# EAGLE design Lantern_Vent (EAGLE 9.6.2)
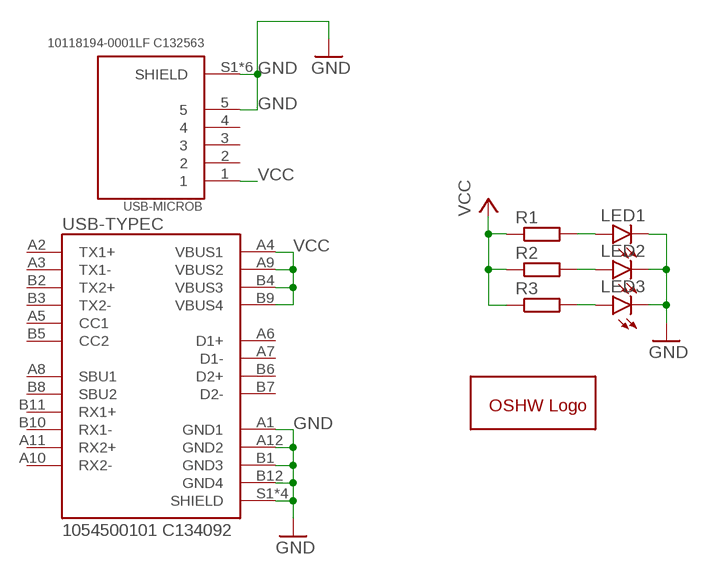
[diagram p0: schematic, sheet 1]

## Parts
GOLD_ORB_SM1  OSHWLOGOLOGO5MM  [OSHW_5MM]
LED1  LEDCHIP-LED0805  [CHIP-LED0805]
LED2  LEDCHIP-LED0805  [CHIP-LED0805]
LED3  LEDCHIP-LED0805  [CHIP-LED0805]
R1  R-EU_R0805  [R0805]
R2  R-EU_R0805  [R0805]
R3  R-EU_R0805  [R0805]
USB-MICROB  10118194-0001LF C132563  10118194-0001LF  [AMPHENOL_10118194-0001LF]
USB-TYPEC  1054500101 C134092  105450-0101  [MOLEX_105450-0101]

## Nets
GND: LED1.C LED2.C LED3.C USB-MICROB.5 USB-MICROB.S1(SHIELD) USB-MICROB.S2(SHIELD) USB-MICROB.S3(SHIELD) USB-MICROB.S4(SHIELD) USB-MICROB.S5(SHIELD) USB-MICROB.S6(SHIELD) USB-TYPEC.A1(GND1) USB-TYPEC.A12(GND2) USB-TYPEC.B1(GND3) USB-TYPEC.B12(GND4) USB-TYPEC.S1(SHIELD) USB-TYPEC.S2(SHIELD) USB-TYPEC.S3(SHIELD) USB-TYPEC.S4(SHIELD)
N$1: LED1.A R1.2
N$2: LED2.A R2.2
N$3: LED3.A R3.2
VCC: R1.1 R2.1 R3.1 USB-MICROB.1 USB-TYPEC.A4(VBUS1) USB-TYPEC.A9(VBUS2) USB-TYPEC.B4(VBUS3) USB-TYPEC.B9(VBUS4)
Unconnected: USB-MICROB.2 USB-MICROB.3 USB-MICROB.4 USB-TYPEC.A2(TX1+) USB-TYPEC.A3(TX1-) USB-TYPEC.A5(CC1) USB-TYPEC.A6(D1+) USB-TYPEC.A7(D1-) USB-TYPEC.A8(SBU1) USB-TYPEC.A10(RX2-) USB-TYPEC.A11(RX2+) USB-TYPEC.B2(TX2+) USB-TYPEC.B3(TX2-) USB-TYPEC.B5(CC2) USB-TYPEC.B6(D2+) USB-TYPEC.B7(D2-) USB-TYPEC.B8(SBU2) USB-TYPEC.B10(RX1-) USB-TYPEC.B11(RX1+)

## Library data of the parts
GOLD_ORB_SM1 = oshw:OSHWLOGO: The OSHW logo for PCB layout
LED1-LED3 = led:LED: LED OSRAM: - CHIPLED LG R971, LG N971, LY N971, LG Q971, LY Q971, LO R971, LY R971 LH N974, LH R974 LS Q976, LO Q976, LY Q976 LO Q996 - Hyper CHIPLED LW Q18S LB Q993, LB Q99A, LB R99A - SideLED LS A670, LO A670, LY A670, LG A670, LP A670 LB A673, LV A673, LT A673, LW A673 LH A674 LY A675 LS A676, LA A676, LO A676, LY A676, LW A676 LS A679, LY A679, LG A679 - Hyper Micro SIDELED® LS Y876, LA Y876, LO Y876, LY Y876 LT Y87S - SmartLED LW L88C, LW L88S LB L89C, LB L89S, LG L890 LS L89K, LO L89K, LY L89K LS L896, LA L896, LO L896, LY L896 - TOPLED LS T670, LO T670, LY T670, LG T670, LP T670 LSG T670, LSP T670, LSY T670, LOP T670, LYG T670 LG T671, LOG T671, LSG T671 LB T673, LV T673, LT T673, LW T673 LH T674 LS T676, LA T676, LO T676, LY T676, LB T676, LH T676, LSB T676, LW T676 LB T67C, LV T67C, LT T67C, LS T67K, LO T67K, LY T67K, LW E67C LS E67B, LA E67B, LO E67B, LY E67B, LB E67C, LV E67C, LT E67C LW T67C LS T679, LY T679, LG T679 LS T770, LO T770, LY T770, LG T770, LP T770 LB T773, LV T773, LT T773, LW T773 LH T774 LS E675, LA E675, LY E675, LS T675 LS T776, LA T776, LO T776, LY T776, LB T776 LHGB T686 LT T68C, LB T68C - Hyper Mini TOPLED® LB M676 - Mini TOPLED Santana® LG M470 LS M47K, LO M47K, LY M47K Source: http://www.osram.convergy.de LUXEON: - LUMILED® LXK2-PW12-R00, LXK2-PW12-S00, LXK2-PW14-U00, LXK2-PW14-V00 LXK2-PM12-R00, LXK2-PM12-S00, LXK2-PM14-U00 LXK2-PE12-Q00, LXK2-PE12-R00, LXK2-PE12-S00, LXK2-PE14-T00, LXK2-PE14-U00 LXK2-PB12-K00, LXK2-PB12-L00, LXK2-PB12-M00, LXK2-PB14-N00, LXK2-PB14-P00, LXK2-PB14-Q00 LXK2-PR12-L00, LXK2-PR12-M00, LXK2-PR14-Q00, LXK2-PR14-R00 LXK2-PD12-Q00, LXK2-PD12-R00, LXK2-PD12-S00 LXK2-PH12-R00, LXK2-PH12-S00 LXK2-PL12-P00, LXK2-PL12-Q00, LXK2-PL12-R00 Source: www.luxeon.com KINGBRIGHT: KA-3528ASYC Source: www.kingbright.com
R1-R3 = rcl:R-EU_: RESISTOR, European symbol; SPICEPREFIX: R
USB-MICROB = 10118194-0001LF:10118194-0001LF: Micro Usb, 2.0 Type b, Rcpt, Smt Check prices <https://snapeda.com/parts/10118194-0001LF/Amphenol%20ICC%20%28FCI%29/view-part/?ref=eda>; ARROW_ELECTRONICS-PURCHASE-URL: https://snapeda.com/shop?store=Arrow+Electronics&id=4816633; AVAILABILITY: Good; DESCRIPTION: USB - micro B USB 2.0 Receptacle Connector 5 Position Surface Mount, Right Angle; Through Hole; DIGIKEY-PURCHASE-URL: https://snapeda.com/shop?store=DigiKey&id=4816633; MF: Amphenol ICC (FCI); MOUSER-PURCHASE-URL: https://snapeda.com/shop?store=Mouser&id=4816633; MP: 10118194-0001LF; PACKAGE: None; PRICE: None
USB-TYPEC = 105450-0101:105450-0101: USB Shielded I/O Receptacle; Type C; Right Angle; Surface Mount; Gold over Nickel Check prices <https://snapeda.com/parts/1054500101/Molex/view-part/?ref=eda>; AVAILABILITY: Good; DESCRIPTION: USB-C (USB TYPE-C) USB 3.2 Gen 2 (USB 3.1 Gen 2, Superspeed + (USB 3.1)) Receptacle Connector 24 Position Surface Mount, Right Angle; Through Hole; DIGIKEY-PURCHASE-URL: https://snapeda.com/shop?store=DigiKey&id=448528; MF: Molex; MP: 1054500101; PACKAGE: None; PRICE: None

## Board
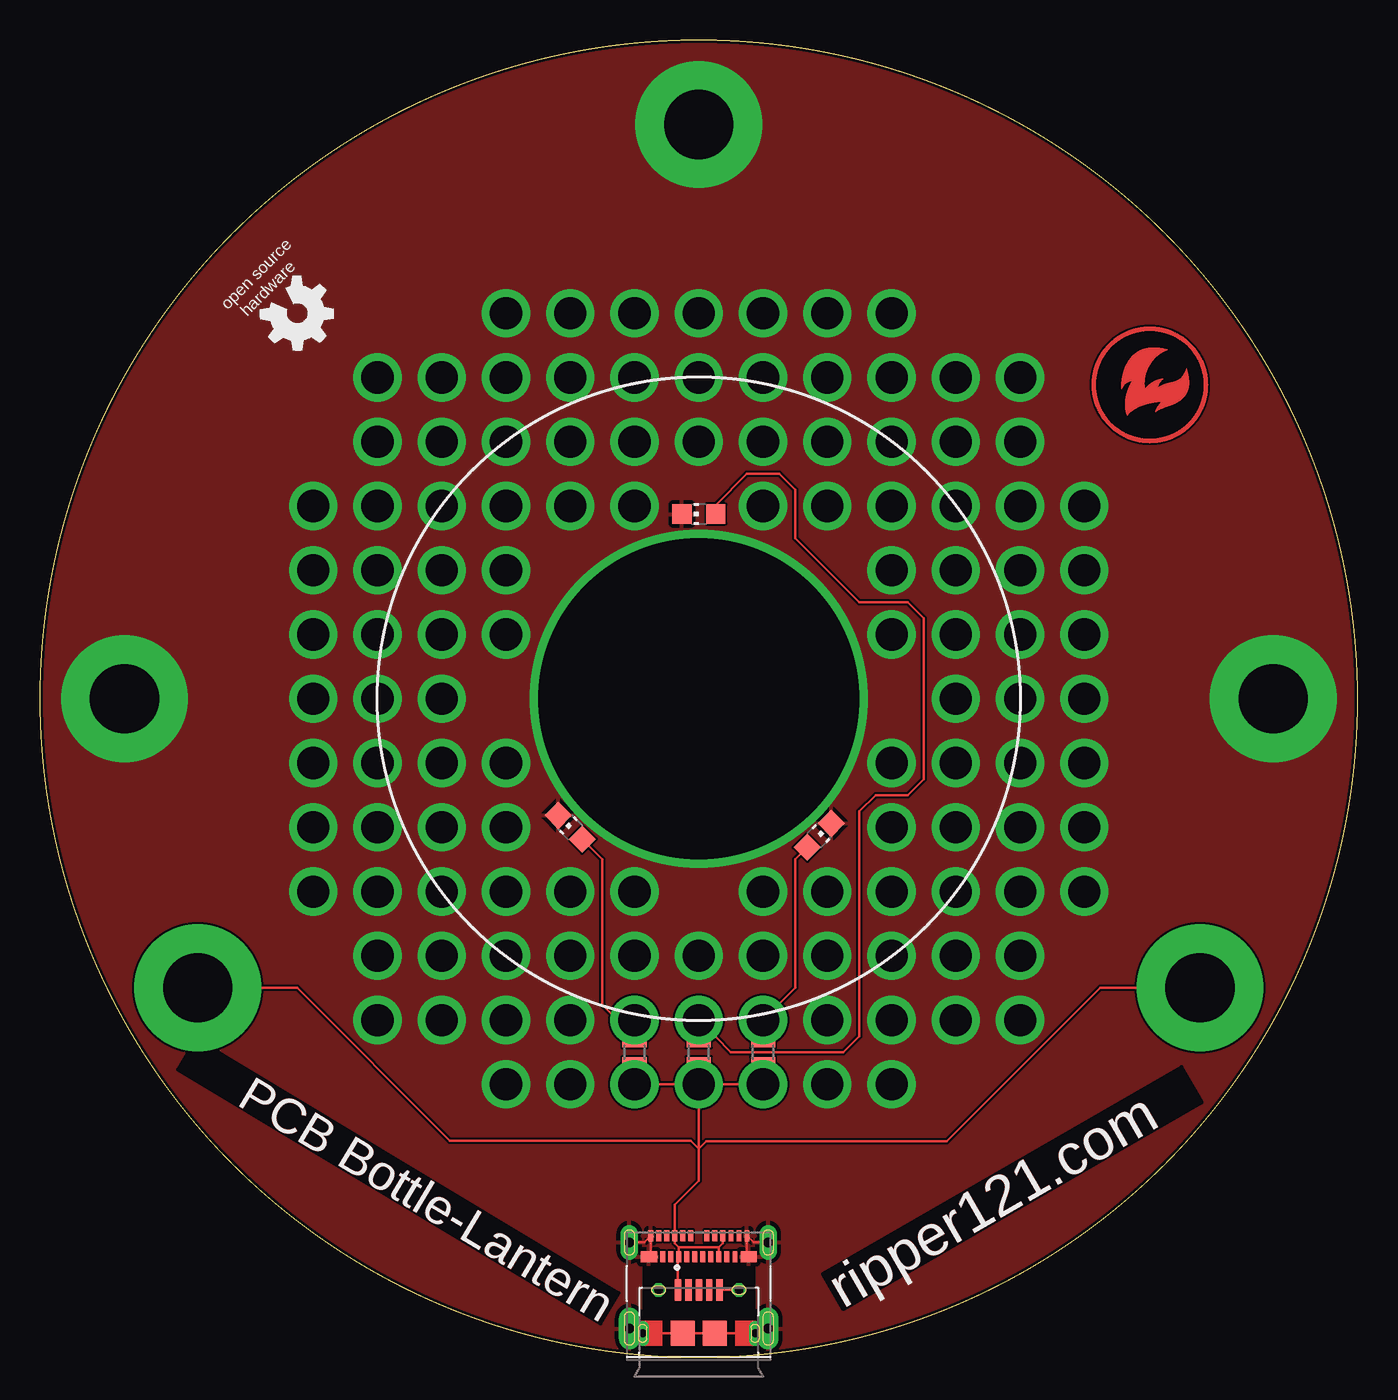
[diagram p1: board, top side]
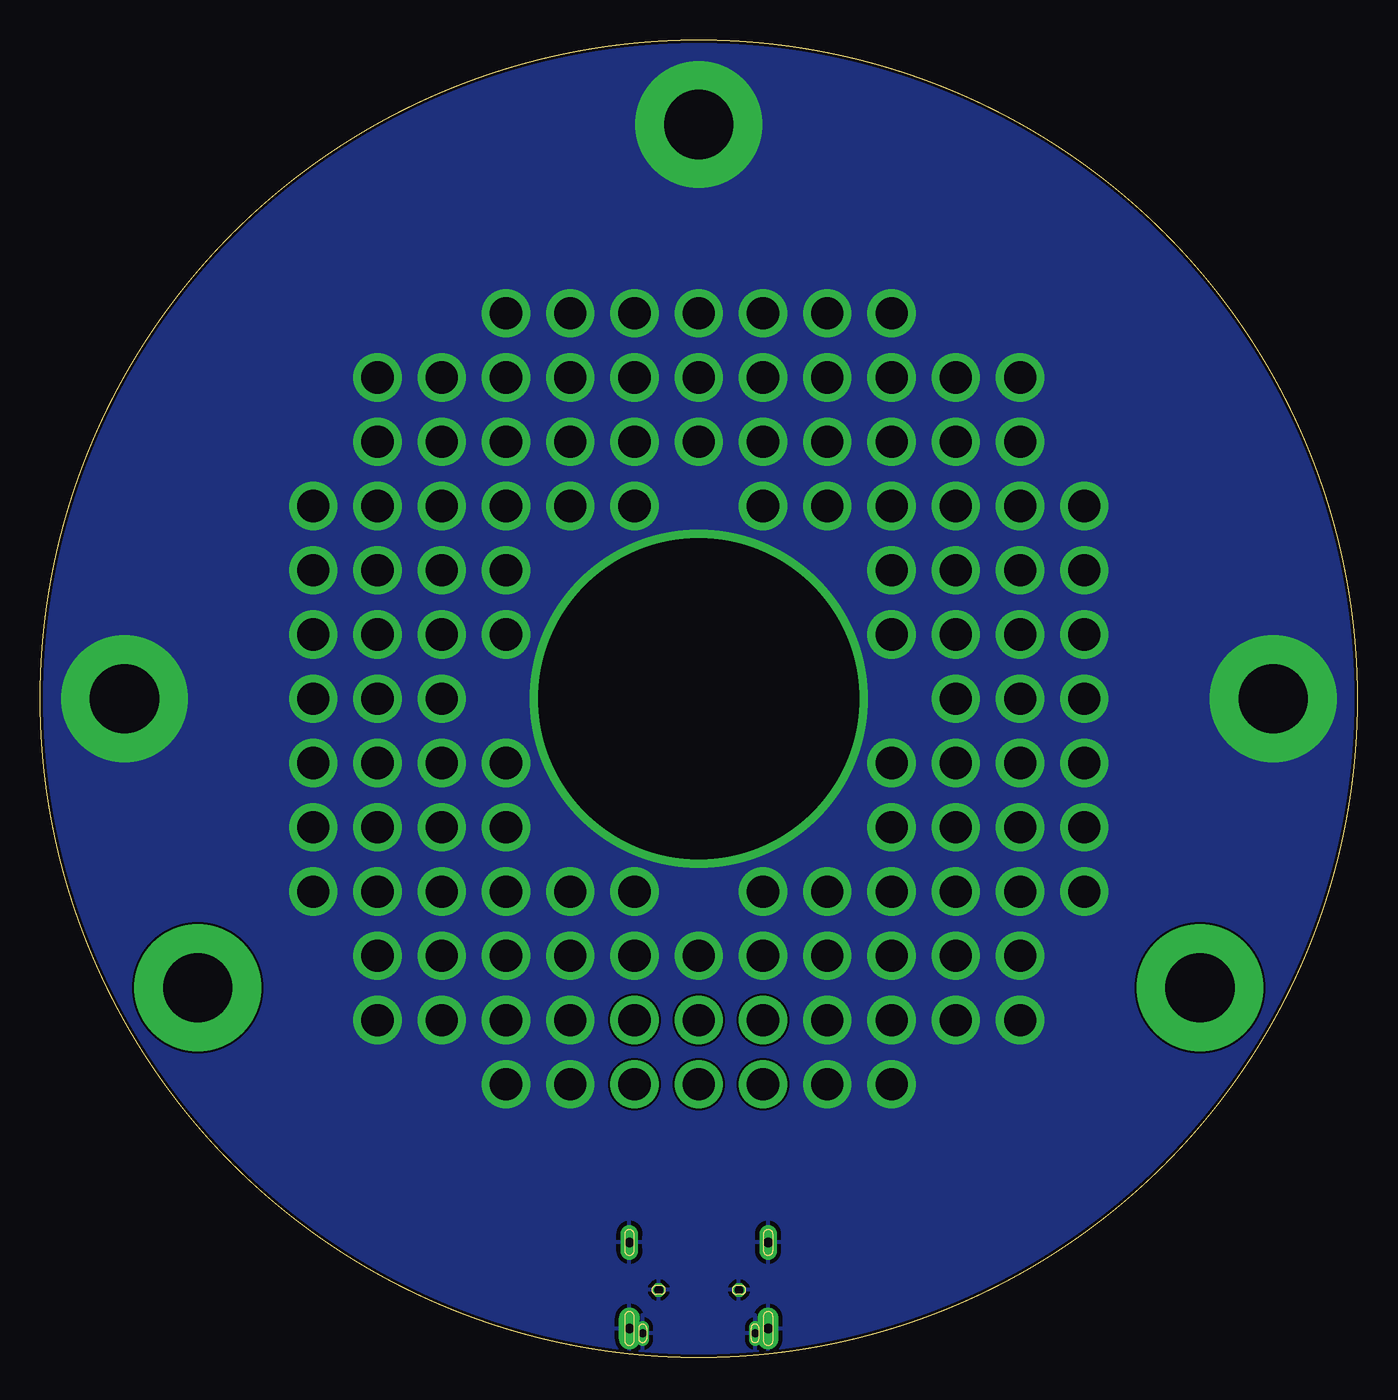
[diagram p2: board, bottom side, seen from below]

Size 82 x 82 mm. Coordinates in mm from the lower left corner, seen from the top.
Outline: circle at 41,41 radius 41
Copper layers (1*16): Top 0.035559375mm / dielectric 1.6mm / Bottom 0.035559375mm
Design rules "jlcpcb2layer *": minimum track width 5mil, minimum drill 12mil, track to track 5mil, track to pad 5mil, pad to pad 5mil, via to via 5mil, smd to smd 5mil, copper to edge 8mil, drill to drill 6mil, minimum pad ring 5mil, minimum via ring 3mil, stop-mask expansion 2.5mil, vias tented up to drill 0mil, thermal gap 10mil

### Footprints (pad centres in the part's own frame; a part is rotated, then mirrored left to right if it is on the bottom)
CHIP-LED0805 = smd 1.2 x 1.2: A 0,-1.05; C 0,1.05
R0805 = smd 1.3 x 1.5: 1 -0.95,0; 2 0.95,0
AMPHENOL_10118194-0001LF = smd 0.4 x 1.35: 1 -1.3,2.7; 2 -0.65,2.7; 3 0,2.7; 4 0.65,2.7; 5 1.3,2.7 | drill 0.55 pad 0.65 octagon: S1 -2.5,2.7; S2 2.5,2.7 | drill 0.5 pad 0.775 long: S3 -3.5,0; S6 3.5,0 | smd 1.5 x 1.55: S4 -1,0; S5 1,0
MOLEX_105450-0101 = smd 0.3 x 0.7: A1 -3,3.77; A2 -2.5,3.77; A3 -2,3.77; A4 -1.5,3.77; A5 -1,3.77; A6 -0.5,3.77; A7 0.5,3.77; A8 1,3.77; A9 1.5,3.77; A10 2,3.77; A11 2.5,3.77; A12 3,3.77; B2 2.25,2.47; B3 1.75,2.47; B4 1.25,2.47; B5 0.75,2.47; B6 0.25,2.47; B7 -0.25,2.47; B8 -0.75,2.47; B9 -1.25,2.47; B10 -1.75,2.47; B11 -2.25,2.47 | smd 1 x 0.7: B1 3.1,2.47; B12 -3.1,2.47 | drill 0.6 pad 1.1 long: S1 -4.32,3.36; S2 4.32,3.36 | drill 0.6 pad 1.3 long: S3 -4.32,-2; S4 4.32,-2

### Placement (x,y rotation side)
GOLD_ORB_SM1  16,65 225 top
LED1  33,33 45 top
LED2  41,52.5 90 top
LED3  48.5,32.5 315 top
R1  37,19 90 top
R2  41,19 90 top
R3  45,19 90 top
USB-MICROB  41,1.5 0 top
USB-TYPEC  41,3.8 0 top

### Tracks (layer width: path | path; a pad name or v marks a point on that pad's centre or on a via)
GND  (via drill 2, 20, 4.3 pad 7.9)
  Top 0.152: USB-TYPEC.S4 45.02,1.5 USB-MICROB.S6 USB-MICROB.S5 USB-MICROB.S4 USB-MICROB.S3 36.98,1.5 USB-TYPEC.S3 | USB-TYPEC.B1 44,6.37 USB-TYPEC.A12 44.41,7.16 USB-TYPEC.S2 | USB-TYPEC.B12 38,6.37 USB-TYPEC.A1 37.59,7.16 USB-TYPEC.S1 | USB-MICROB.5 USB-MICROB.S2
  other vias: 5.25,41 41,76.75 76.75,41 41,41 57,41 61,41 65,41 25,41 21,41 17,41 53,45 57,45 61,45 65,45 29,45 25,45 21,45 17,45 53,49 57,49 61,49 65,49 29,49 25,49 21,49 17,49 45,53 49,53 53,53 57,53 61,53 65,53 37,53 33,53 29,53 25,53 21,53 17,53 41,57 45,57 49,57 53,57 57,57 61,57 37,57 33,57 29,57 25,57 21,57 41,61 45,61 49,61 53,61 57,61 61,61 37,61 33,61 29,61 25,61 21,61 41,65 45,65 49,65 53,65 37,65 33,65 29,65 53,37 57,37 61,37 65,37 29,37 25,37 21,37 17,37 53,33 57,33 61,33 65,33 29,33 25,33 21,33 17,33 45,29 49,29 53,29 57,29 61,29 65,29 37,29 33,29 29,29 25,29 21,29 17,29 41,25 45,25 49,25 53,25 57,25 61,25 37,25 33,25 29,25 25,25 21,25 49,21 53,21 57,21 61,21 33,21 29,21 25,21 21,21 49,17 53,17 33,17 29,17
  pour Top: -0.91,41 -0.91,82.91 57.51,82.91 82.91,82.91 82.91,41 82.91,-0.91 41,-0.91 -0.91,-0.91
  pour Bottom: -0.91,41 -0.91,82.91 41,82.91 82.91,82.91 82.91,41 82.91,-0.91 42.27,-0.91 -0.91,-0.91
N$1  (via drill 2)
  Top 0.152: LED1.A 35,31 35,21.95 R1.2 v37,21
N$2  (via drill 2)
  Top 0.152: LED2.A 42.05,53.05 44,55 46,55 47,54 47,51 51,47 54,47 55,46 55,36 54,35 52,35 51,34 51,20 50,19 43,19 42.05,19.95 R2.2 v41,21
N$3  (via drill 2)
  Top 0.152: LED3.A 47,31 47,23 v45,21 R3.2
VCC  (via drill 2, 4.3 pad 7.9)
  Top 0.152: USB-MICROB.1 39.7,6.22 USB-TYPEC.B9 39.75,6.85 | 39.75,6.85 39.5,7.1 USB-TYPEC.A4 39.5,9.5 41,11 41,13 | USB-TYPEC.A9 42.5,7.1 42.25,6.85 | 42.25,6.85 USB-TYPEC.B4 | 39.75,6.85 42.25,6.85 | v72.2,23 66,23 56.45,13.45 41.45,13.45 41,13 | v9.8,23 16,23 25.5,13.5 40.5,13.5 41,13 | 41,13 v41,17 | R2.1 v41,17 | R3.1 v45,17 v41,17 | v41,17 v37,17 R1.1
(copper drawn outside any net)
  shapes: Top area x1573

### Text on the board
Top: PCB Bottle-Lantern | ripper121.com
tNames: PCB Bottle-Lantern | ripper121.com